# Altium schematic sheet RemoteShematics.SchDoc
size A4
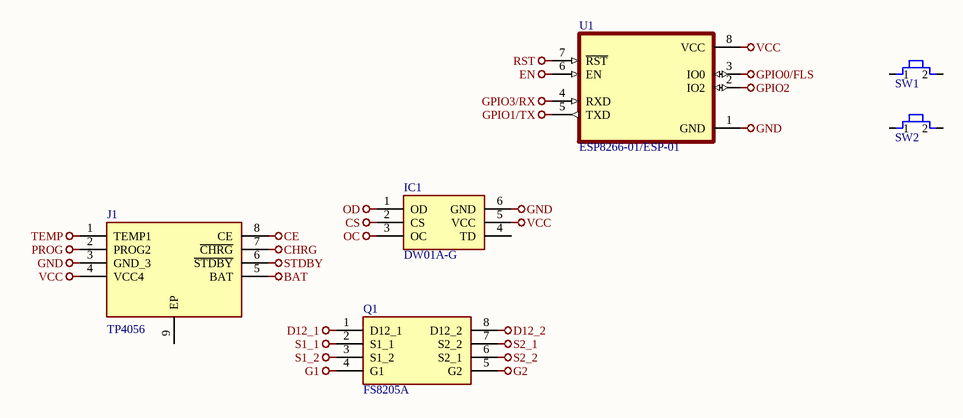
[diagram p0: RemoteShematics.SchDoc]

## Parts
IC1  DW01A-G  [SOT95P190X145-6N]
J1  TP4056  [SOIC127P600X175-9N]
Q1  FS8205A  [SOP65P640X120-8N]
SW1  Switch button 6 x 3.5 x 2.5 mm  [Switch button  6 x 3.5 x 2.5 mm]  (value not drawn)
SW2  Switch button 6 x 3.5 x 2.5 mm  [Switch button  6 x 3.5 x 2.5 mm]  (value not drawn)
U1  ESP8266-01/ESP-01  [XCVR_ESP8266-01/ESP-01]

## Nets
BAT: J1.5(BAT)
CE: J1.8(CE)
CHRG: J1.7(~{CHRG})
CS: IC1.2(CS)
D12_1: Q1.1(D12_1)
D12_2: Q1.8(D12_2)
EN: U1.6(EN)
G1: Q1.4(G1)
G2: Q1.5(G2)
GND: IC1.6(GND) J1.3(GND_3) U1.1(GND)
GPIO0/FLS: U1.3(IO0)
GPIO1/TX: U1.5(TXD)
GPIO2: U1.2(IO2)
GPIO3/RX: U1.4(RXD)
OC: IC1.3(OC)
OD: IC1.1(OD)
PROG: J1.2(PROG2)
RST: U1.7(~{RST})
S1_1: Q1.2(S1_1)
S1_2: Q1.3(S1_2)
S2_1: Q1.7(S2_2)
S2_2: Q1.6(S2_1)
STDBY: J1.6(~{STDBY})
TEMP: J1.1(TEMP1)
VCC: IC1.5(VCC) J1.4(VCC4) U1.8(VCC)

Not connected (* = marked no-connect by the designer): IC1 4(TD); J1 9(EP); SW1 1 2; SW2 1 2

## Library data of the parts
IC1 = DW01A-G: Integrated Circuit; Manufacturer_Name: SII Semiconductor; Datasheet Link: http://www.ic-fortune.com/upload/Download/DW01x-DS-17_EN.pdf; Height: 1.45mm; Manufacturer_Part_Number: DW01A-G
J1 = TP4056: Connector; Manufacturer_Name: NanJing Top Power; Datasheet Link: https://dlnmh9ip6v2uc.cloudfront.net/datasheets/Prototyping/TP4056.pdf; Height: 1.75mm; Manufacturer_Part_Number: TP4056
Q1 = FS8205A: Transistor; Manufacturer_Name: SII Semiconductor; Datasheet Link: http://www.ic-fortune.com/upload/Download/FS8205A-DS-12_EN.pdf; Height: 1.2mm; Manufacturer_Part_Number: FS8205A
SW1 SW2 = Switch button  6 x 3.5 x 2.5 mm
U1 = ESP8266-01/ESP-01: MakerFocus 4pcs ESP8266 ESP-01 Serial Wireless WiFi Transceiver Receiver Module 1MB SPI Flash DC3.0-3.6V Internet of Things WiFi Module Board Compatible with Ar duino; Value: *; MP: ESP8266-01/ESP-01; Package: None; Availability: Unavailable; Price: None